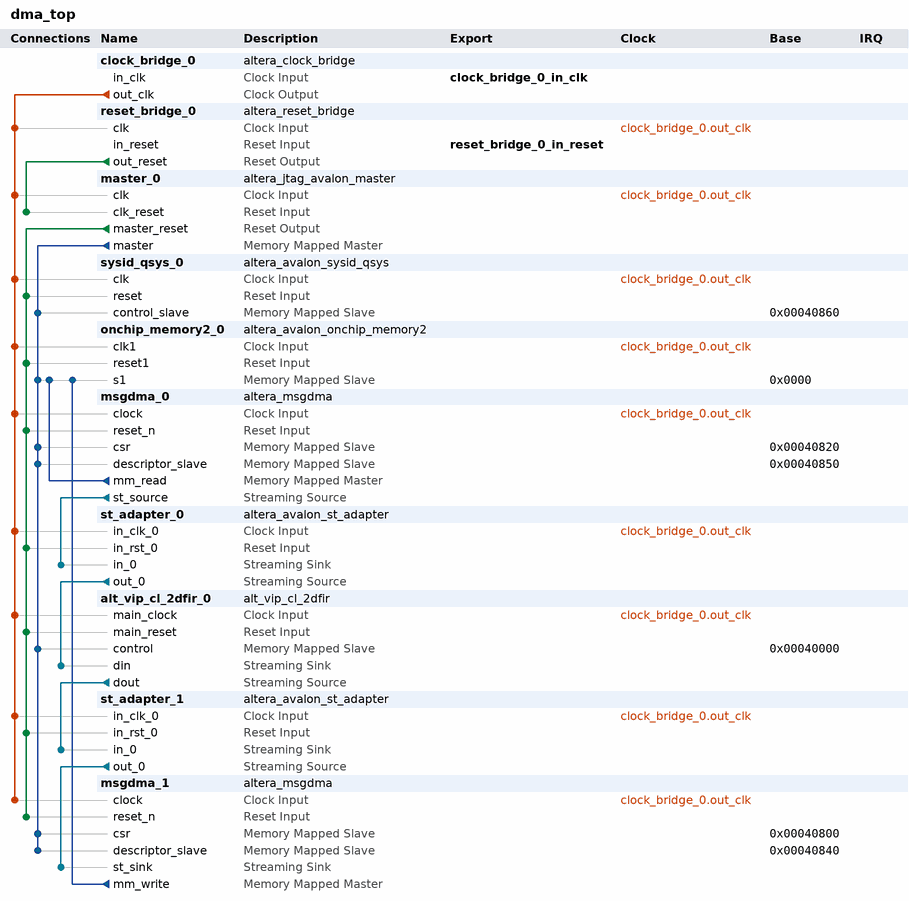
[diagram p0: system contents]
# Platform Designer (Qsys) system dma_top, MAX 10 10M50DAF484C6GES
# Parameters at their usual value, and those the tool derives, are not listed.
package require -exact qsys 23.1
create_system dma_top
set_project_property DEVICE_FAMILY {MAX 10}
set_project_property DEVICE 10M50DAF484C6GES

add_instance clock_bridge_0 altera_clock_bridge 23.1
set_instance_parameter_value clock_bridge_0 DERIVED_CLOCK_RATE 0
set_instance_parameter_value clock_bridge_0 EXPLICIT_CLOCK_RATE 50000000

add_instance reset_bridge_0 altera_reset_bridge 23.1
set_instance_parameter_value reset_bridge_0 ACTIVE_LOW_RESET 1
set_instance_parameter_value reset_bridge_0 SYNCHRONOUS_EDGES deassert

add_instance master_0 altera_jtag_avalon_master 23.1

add_instance sysid_qsys_0 altera_avalon_sysid_qsys 23.1
set_instance_parameter_value sysid_qsys_0 id -889292096

add_instance onchip_memory2_0 altera_avalon_onchip_memory2 23.1
set_instance_parameter_value onchip_memory2_0 dataWidth 32
set_instance_parameter_value onchip_memory2_0 dualPort false
set_instance_parameter_value onchip_memory2_0 initMemContent true
set_instance_parameter_value onchip_memory2_0 initializationFileName onchip_mem.hex
set_instance_parameter_value onchip_memory2_0 memorySize 131072

add_instance msgdma_0 altera_msgdma 23.1
set_instance_parameter_value msgdma_0 BURST_ENABLE 0
set_instance_parameter_value msgdma_0 DATA_FIFO_DEPTH 32
set_instance_parameter_value msgdma_0 DATA_WIDTH 32
set_instance_parameter_value msgdma_0 DESCRIPTOR_FIFO_DEPTH 128
set_instance_parameter_value msgdma_0 ENHANCED_FEATURES 0
set_instance_parameter_value msgdma_0 ERROR_ENABLE 0
set_instance_parameter_value msgdma_0 MAX_BURST_COUNT 2
set_instance_parameter_value msgdma_0 MAX_BYTE 131072
set_instance_parameter_value msgdma_0 MODE 1
set_instance_parameter_value msgdma_0 PACKET_ENABLE 1
set_instance_parameter_value msgdma_0 TRANSFER_TYPE {Aligned Accesses}

add_instance st_adapter_0 altera_avalon_st_adapter 23.1
set_instance_parameter_value st_adapter_0 inBitsPerSymbol 8
set_instance_parameter_value st_adapter_0 inChannelWidth 0
set_instance_parameter_value st_adapter_0 inDataWidth 32
set_instance_parameter_value st_adapter_0 inErrorWidth 0
set_instance_parameter_value st_adapter_0 inMaxChannel 0
set_instance_parameter_value st_adapter_0 inReadyLatency 0
set_instance_parameter_value st_adapter_0 inUseEmptyPort 1
set_instance_parameter_value st_adapter_0 inUsePackets 1
set_instance_parameter_value st_adapter_0 inUseReady 1
set_instance_parameter_value st_adapter_0 inUseValid 1
set_instance_parameter_value st_adapter_0 outChannelWidth 0
set_instance_parameter_value st_adapter_0 outDataWidth 32
set_instance_parameter_value st_adapter_0 outErrorWidth 0
set_instance_parameter_value st_adapter_0 outMaxChannel 0
set_instance_parameter_value st_adapter_0 outReadyLatency 1
set_instance_parameter_value st_adapter_0 outUseEmptyPort 1
set_instance_parameter_value st_adapter_0 outUseReady 1
set_instance_parameter_value st_adapter_0 outUseValid 1

add_instance alt_vip_cl_2dfir_0 alt_vip_cl_2dfir 23.1
set_instance_parameter_value alt_vip_cl_2dfir_0 ALGORITHM_NAME STANDARD_FIR
set_instance_parameter_value alt_vip_cl_2dfir_0 BITS_PER_SYMBOL_IN 8
set_instance_parameter_value alt_vip_cl_2dfir_0 BITS_PER_SYMBOL_OUT 8
set_instance_parameter_value alt_vip_cl_2dfir_0 COEFF_FRACTION_BITS 7
set_instance_parameter_value alt_vip_cl_2dfir_0 COEFF_INTEGER_BITS 1
set_instance_parameter_value alt_vip_cl_2dfir_0 COEFF_SIGNED 1
set_instance_parameter_value alt_vip_cl_2dfir_0 COLOR_PLANES_ARE_IN_PARALLEL 1
set_instance_parameter_value alt_vip_cl_2dfir_0 DEFAULT_LOWER_BLUR 0
set_instance_parameter_value alt_vip_cl_2dfir_0 DEFAULT_UPPER_BLUR 15
set_instance_parameter_value alt_vip_cl_2dfir_0 DIAG_SYMMETRIC 0
set_instance_parameter_value alt_vip_cl_2dfir_0 DO_MIRRORING 1
set_instance_parameter_value alt_vip_cl_2dfir_0 ENABLE_WIDE_BLUR_SHARPEN 1
set_instance_parameter_value alt_vip_cl_2dfir_0 EXTRA_PIPELINING 0
set_instance_parameter_value alt_vip_cl_2dfir_0 FAMILY {MAX 10}
set_instance_parameter_value alt_vip_cl_2dfir_0 FIXED_COEFF_FILE {<enter file name (including full path)>}
set_instance_parameter_value alt_vip_cl_2dfir_0 H_SYMMETRIC 0
set_instance_parameter_value alt_vip_cl_2dfir_0 H_TAPS 3
set_instance_parameter_value alt_vip_cl_2dfir_0 INPUT_GUARD_BANDS_ENABLE 0
set_instance_parameter_value alt_vip_cl_2dfir_0 INPUT_GUARD_BAND_LOWER 0
set_instance_parameter_value alt_vip_cl_2dfir_0 INPUT_GUARD_BAND_UPPER 255
set_instance_parameter_value alt_vip_cl_2dfir_0 IS_422 0
set_instance_parameter_value alt_vip_cl_2dfir_0 LIMITED_READBACK 0
set_instance_parameter_value alt_vip_cl_2dfir_0 MAX_HEIGHT 200
set_instance_parameter_value alt_vip_cl_2dfir_0 MAX_WIDTH 320
set_instance_parameter_value alt_vip_cl_2dfir_0 MOVE_BINARY_POINT_RIGHT 0
set_instance_parameter_value alt_vip_cl_2dfir_0 NO_BLANKING 1
set_instance_parameter_value alt_vip_cl_2dfir_0 NUMBER_OF_COLOR_PLANES 1
set_instance_parameter_value alt_vip_cl_2dfir_0 OUTPUT_GUARD_BANDS_ENABLE 0
set_instance_parameter_value alt_vip_cl_2dfir_0 OUTPUT_GUARD_BAND_LOWER 0
set_instance_parameter_value alt_vip_cl_2dfir_0 OUTPUT_GUARD_BAND_UPPER 255
set_instance_parameter_value alt_vip_cl_2dfir_0 PIXELS_IN_PARALLEL 4
set_instance_parameter_value alt_vip_cl_2dfir_0 ROUNDING_METHOD ROUND_HALF_UP
set_instance_parameter_value alt_vip_cl_2dfir_0 RUNTIME_CONTROL 1
set_instance_parameter_value alt_vip_cl_2dfir_0 USER_PACKET_SUPPORT NONE_ALLOWED
set_instance_parameter_value alt_vip_cl_2dfir_0 V_SYMMETRIC 0
set_instance_parameter_value alt_vip_cl_2dfir_0 V_TAPS 3

add_instance st_adapter_1 altera_avalon_st_adapter 23.1
set_instance_parameter_value st_adapter_1 inBitsPerSymbol 8
set_instance_parameter_value st_adapter_1 inChannelWidth 0
set_instance_parameter_value st_adapter_1 inDataWidth 32
set_instance_parameter_value st_adapter_1 inErrorWidth 0
set_instance_parameter_value st_adapter_1 inMaxChannel 0
set_instance_parameter_value st_adapter_1 inReadyLatency 1
set_instance_parameter_value st_adapter_1 inUseEmptyPort 1
set_instance_parameter_value st_adapter_1 inUsePackets 1
set_instance_parameter_value st_adapter_1 inUseReady 1
set_instance_parameter_value st_adapter_1 inUseValid 1
set_instance_parameter_value st_adapter_1 outChannelWidth 0
set_instance_parameter_value st_adapter_1 outDataWidth 32
set_instance_parameter_value st_adapter_1 outErrorWidth 0
set_instance_parameter_value st_adapter_1 outMaxChannel 0
set_instance_parameter_value st_adapter_1 outReadyLatency 0
set_instance_parameter_value st_adapter_1 outUseEmptyPort 1
set_instance_parameter_value st_adapter_1 outUseReady 1
set_instance_parameter_value st_adapter_1 outUseValid 1

add_instance msgdma_1 altera_msgdma 23.1
set_instance_parameter_value msgdma_1 BURST_ENABLE 0
set_instance_parameter_value msgdma_1 DATA_FIFO_DEPTH 32
set_instance_parameter_value msgdma_1 DATA_WIDTH 32
set_instance_parameter_value msgdma_1 DESCRIPTOR_FIFO_DEPTH 128
set_instance_parameter_value msgdma_1 ENHANCED_FEATURES 0
set_instance_parameter_value msgdma_1 ERROR_ENABLE 0
set_instance_parameter_value msgdma_1 MAX_BURST_COUNT 2
set_instance_parameter_value msgdma_1 MAX_BYTE 131072
set_instance_parameter_value msgdma_1 MODE 2
set_instance_parameter_value msgdma_1 PACKET_ENABLE 1
set_instance_parameter_value msgdma_1 TRANSFER_TYPE {Aligned Accesses}

# connections
add_connection clock_bridge_0.out_clk alt_vip_cl_2dfir_0.main_clock clock
add_connection clock_bridge_0.out_clk master_0.clk clock
add_connection clock_bridge_0.out_clk msgdma_0.clock clock
add_connection clock_bridge_0.out_clk msgdma_1.clock clock
add_connection clock_bridge_0.out_clk onchip_memory2_0.clk1 clock
add_connection clock_bridge_0.out_clk reset_bridge_0.clk clock
add_connection clock_bridge_0.out_clk st_adapter_0.in_clk_0 clock
add_connection clock_bridge_0.out_clk st_adapter_1.in_clk_0 clock
add_connection clock_bridge_0.out_clk sysid_qsys_0.clk clock
add_connection master_0.master_reset alt_vip_cl_2dfir_0.main_reset reset
add_connection master_0.master_reset msgdma_0.reset_n reset
add_connection master_0.master_reset msgdma_1.reset_n reset
add_connection master_0.master_reset onchip_memory2_0.reset1 reset
add_connection master_0.master_reset st_adapter_0.in_rst_0 reset
add_connection master_0.master_reset st_adapter_1.in_rst_0 reset
add_connection master_0.master_reset sysid_qsys_0.reset reset
add_connection reset_bridge_0.out_reset master_0.clk_reset reset
add_connection master_0.master alt_vip_cl_2dfir_0.control avalon
set_connection_parameter_value master_0.master/alt_vip_cl_2dfir_0.control baseAddress 0x00040000
add_connection master_0.master msgdma_0.csr avalon
set_connection_parameter_value master_0.master/msgdma_0.csr baseAddress 0x00040820
add_connection master_0.master msgdma_0.descriptor_slave avalon
set_connection_parameter_value master_0.master/msgdma_0.descriptor_slave baseAddress 0x00040850
add_connection master_0.master msgdma_1.csr avalon
set_connection_parameter_value master_0.master/msgdma_1.csr baseAddress 0x00040800
add_connection master_0.master msgdma_1.descriptor_slave avalon
set_connection_parameter_value master_0.master/msgdma_1.descriptor_slave baseAddress 0x00040840
add_connection master_0.master onchip_memory2_0.s1 avalon
set_connection_parameter_value master_0.master/onchip_memory2_0.s1 baseAddress 0x0000
add_connection master_0.master sysid_qsys_0.control_slave avalon
set_connection_parameter_value master_0.master/sysid_qsys_0.control_slave baseAddress 0x00040860
add_connection msgdma_0.mm_read onchip_memory2_0.s1 avalon
set_connection_parameter_value msgdma_0.mm_read/onchip_memory2_0.s1 baseAddress 0x0000
add_connection msgdma_1.mm_write onchip_memory2_0.s1 avalon
set_connection_parameter_value msgdma_1.mm_write/onchip_memory2_0.s1 baseAddress 0x0000
add_connection alt_vip_cl_2dfir_0.dout st_adapter_1.in_0 avalon_streaming
add_connection msgdma_0.st_source st_adapter_0.in_0 avalon_streaming
add_connection st_adapter_0.out_0 alt_vip_cl_2dfir_0.din avalon_streaming
add_connection st_adapter_1.out_0 msgdma_1.st_sink avalon_streaming

# exported interfaces
add_interface clock_bridge_0_in_clk clock sink
set_interface_property clock_bridge_0_in_clk EXPORT_OF clock_bridge_0.in_clk
add_interface reset_bridge_0_in_reset reset sink
set_interface_property reset_bridge_0_in_reset EXPORT_OF reset_bridge_0.in_reset

set_interconnect_requirement {$system} qsys_mm.clockCrossingAdapter HANDSHAKE
set_interconnect_requirement {$system} qsys_mm.enableEccProtection FALSE
set_interconnect_requirement {$system} qsys_mm.insertDefaultSlave FALSE
set_interconnect_requirement {$system} qsys_mm.maxAdditionalLatency 1

save_system dma_top.qsys
